# EasyEDA Pro project STM32C8.eprj

# Schematic STM32C8
Board Name: STM32C8; Create Date: 2022-11-13; Page Name: Core; Project Name: STM32C8; Schematic Name: STM32C8; Update Date: 2025-06-07; Company: My Company; Page Size: A4; Version: V1.0
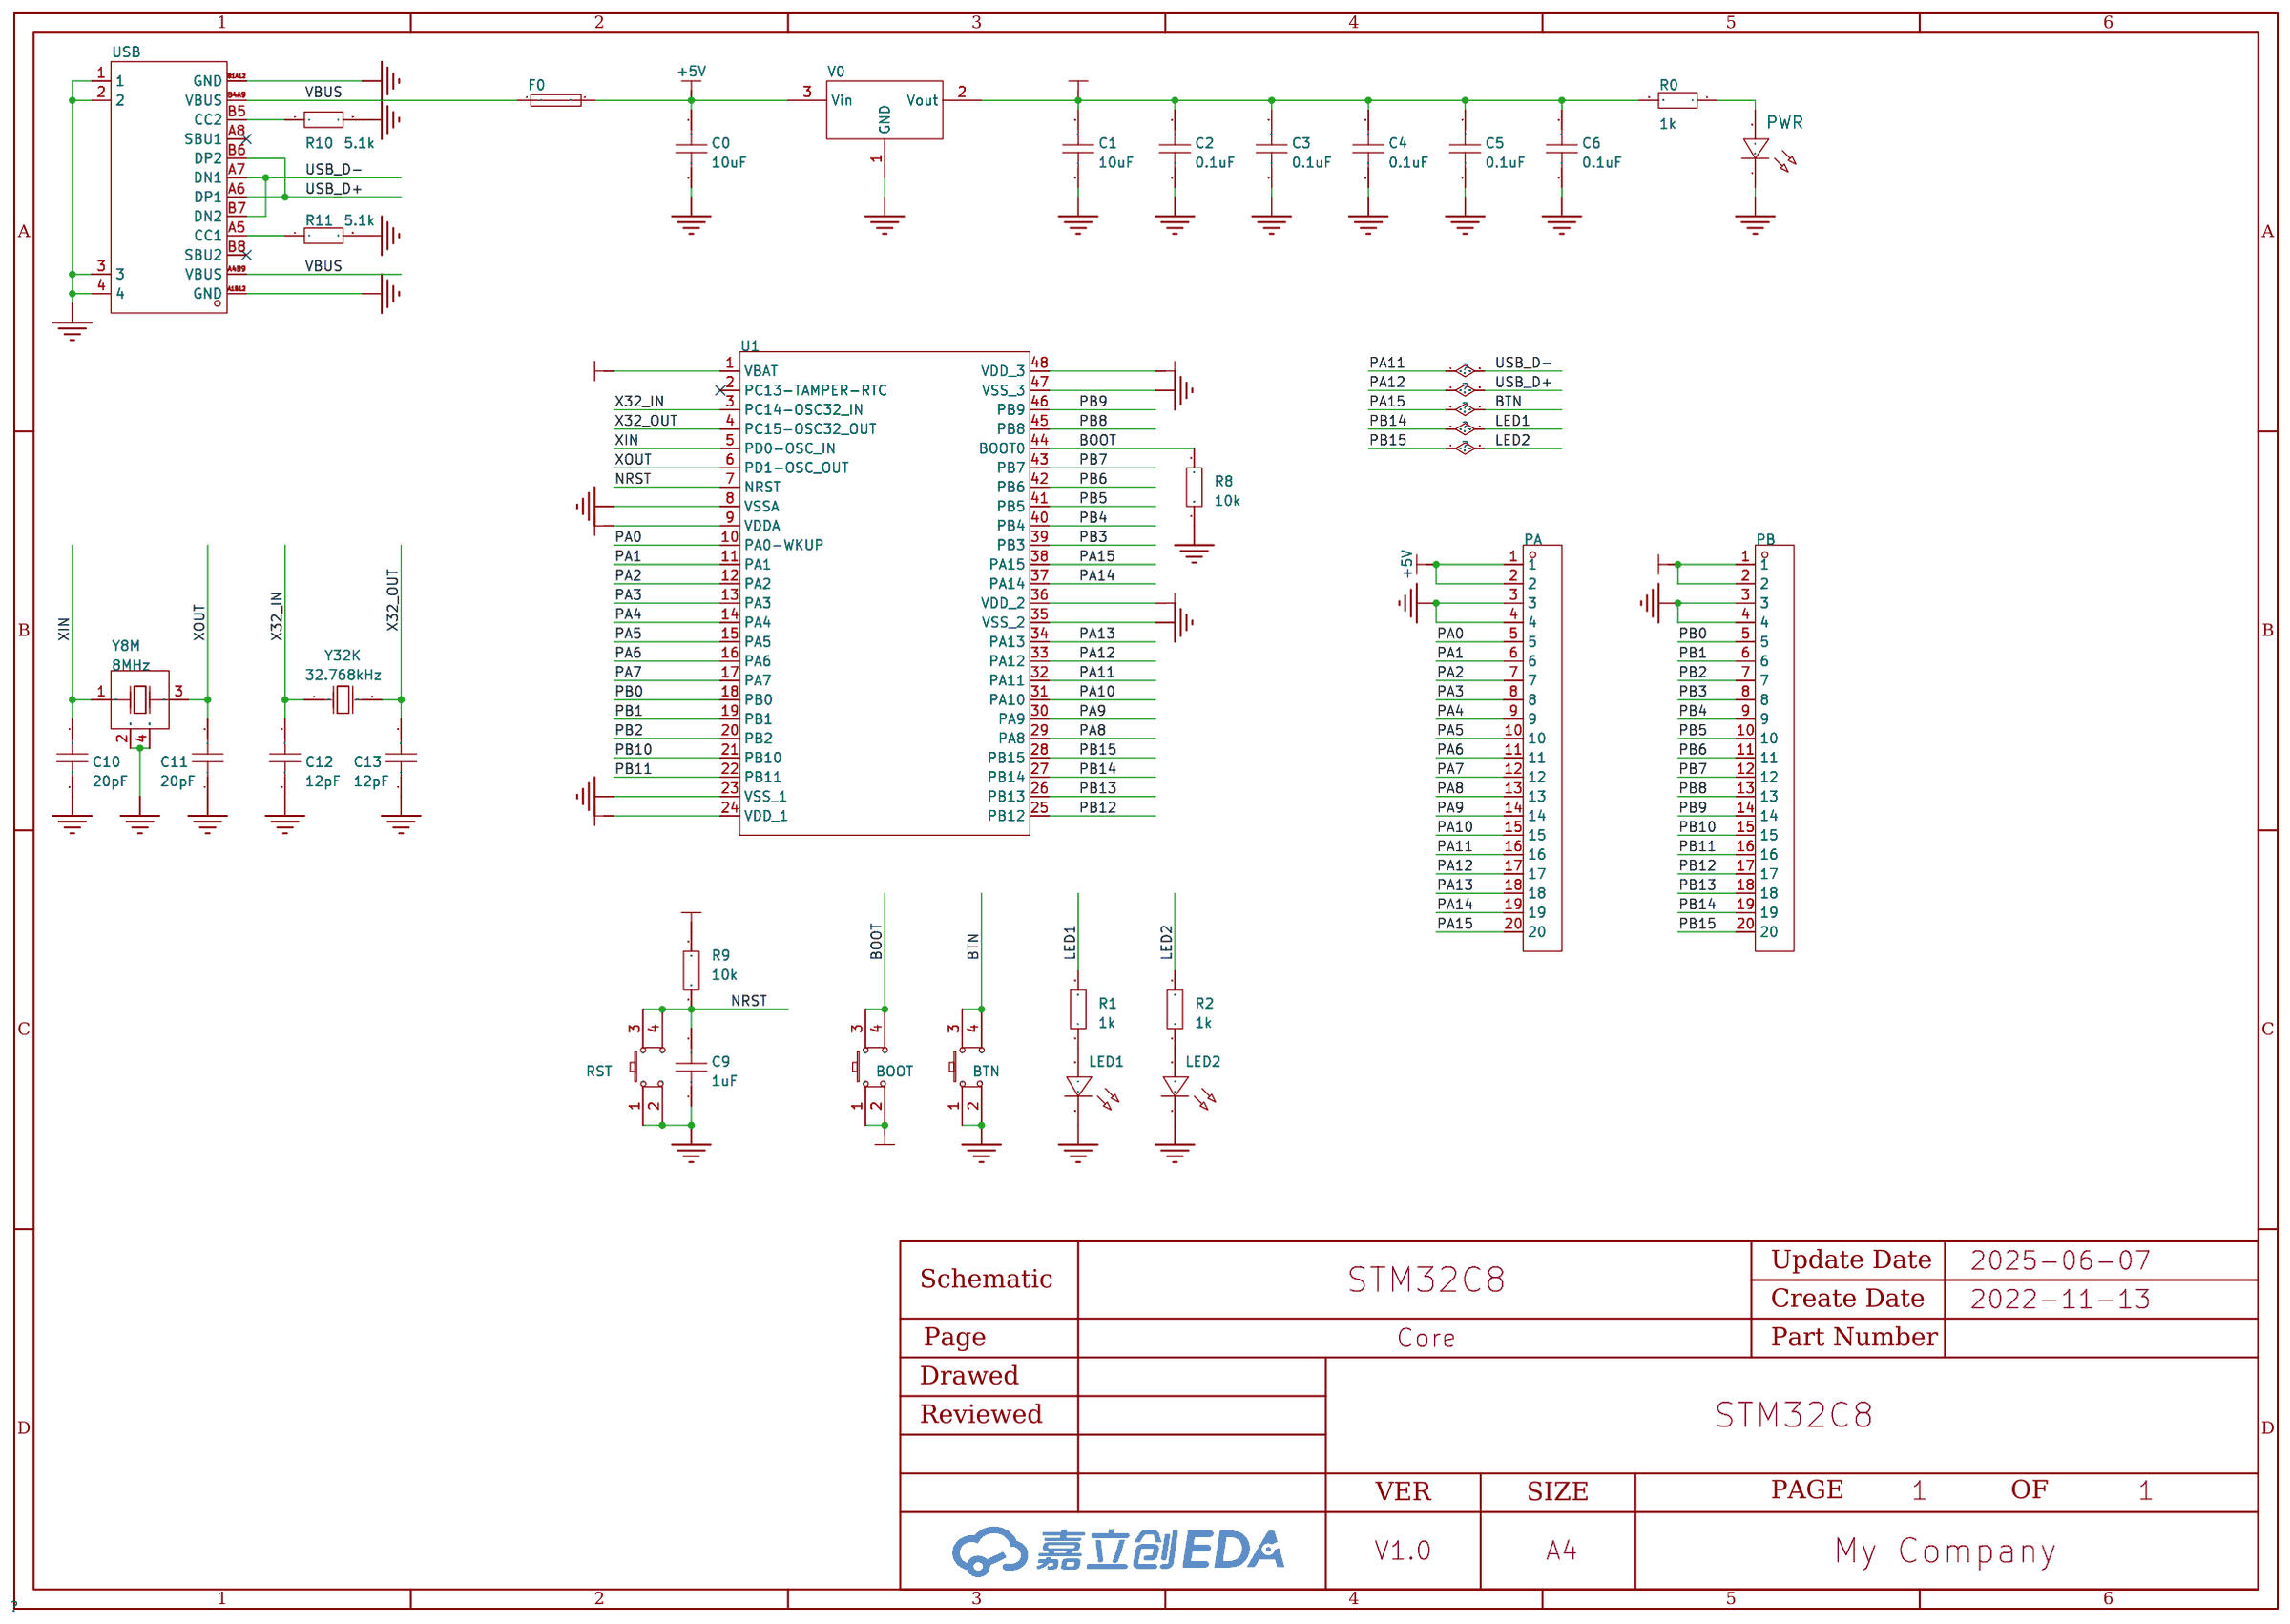
[diagram p0: schematic sheet]

## Parts
BOOT  PTS815SJK250SMTRLFS  [SW-SMD_4P-L4.2-W3.3-P2.15-LS5.1]
BTN  PTS815SJK250SMTRLFS  [SW-SMD_4P-L4.2-W3.3-P2.15-LS5.1]
C0  10uF  [C0603]
C1  10uF  [C0603]
C2  0.1uF  [C0603]
C3  0.1uF  [C0603]
C4  0.1uF  [C0603]
C5  0.1uF  [C0603]
C6  0.1uF  [C0603]
C9  1uF  [C0603]
C10  20pF  [C0603]
C11  20pF  [C0603]
C12  12pF  [C0603]
C13  12pF  [C0603]
F0  JK-nSMD100-16  [F1206]
LED1  -  [LED0603-RD_BLUE]
LED2  -  [LED0603-RD_BLUE]
PA  -  [HDR-TH_20P-P2.54-V-M-1]
PB  -  [HDR-TH_20P-P2.54-V-M-1]
PWR  -  [LED0603-RD_BLUE]
R0  1k  [R0603]
R1  1k  [R0603]
R2  1k  [R0603]
R8  10k  [R0603]
R9  10k  [R0603]
R10  5.1k  [R0603]
R11  5.1k  [R0603]
RST  PTS815SJK250SMTRLFS  [SW-SMD_4P-L4.2-W3.3-P2.15-LS5.1]
U1  STM32F103C8T6  [LQFP-48_L7.0-W7.0-P0.50-LS9.0-BL]
USB  USB-TYPE-C-017  [USB-TYPE-C-SMD_C9900008089]
V0  AMS1117-3.3  [SOT-89-3_L4.5-W2.5-P1.50-LS4.2-BR]
Y8M  8MHz  [CRYSTAL-SMD_4P-L3.2-W2.5-BL]
Y32K  32.768kHz  [OSC-SMD_L3.2-W1.5]

## Library data of the parts
BOOT BTN RST = PTS815SJK250SMTRLFS: 操作寿命10万次，使用温度-20°C 至 70°C,尺寸4.20mmx3.20mmx2.50mm，操作力度2.5N; LCSC Part Name: 轻触开关; Supplier Part: C918859; Manufacturer: C&K; Supplier Footprint: SMD; JLCPCB Part Class: 扩展库; Datasheet: https://atta.szlcsc.com/upload/public/pdf/source/20190916/C411883_4F77F16E1D8E48DC707D8949CEE7CF80.pdf; Supplier: LCSC
C0-C6 C9-C13 = CAP_0603: 容值:100nF;精度:±10%;额定电压:50V;温度系数:X7R;; Supplier Footprint: 0603
F0 = JK-nSMD100-16: LCSC Part Name: 16V 1A 1206自恢复; Supplier Part: C369161; Manufacturer: JK(金科); Supplier Footprint: 1206; JLCPCB Part Class: 扩展库; Datasheet: https://atta.szlcsc.com/upload/public/pdf/source/20190807/C409806_27B0F7EFFA3D5CEE60CCD1EE0A933E0A.pdf; Supplier: LCSC; Voltage - Max: 16V; Current - Max: 100A; Hold Current: 1A; Trip Current: 1.8A; Time to Trip(Max): 300ms
LED1 LED2 = LED_0603-B: 照明颜色:蓝色;主波长/色坐标:465~475nm;; Supplier Footprint: 0603; Supplier Part: C72041
PA PB = HDR-M_2.54_1x20P: 间距:2.54mm;总PIN位数:20;排数:1;插针结构:-;行距:-;安装类型:直插;圆针/方针:-;额定电流:-;额定电压:-;配合针长度:-;塑高:-;触头材质:黄铜;触头镀层:-;颜色:黑色;; Supplier Part: C50981; Supplier Footprint: 插件
PWR = LED_0603-R: 发光颜色:红灯;二极管配置:-;透镜颜色:无色透明;主波长:617.5nm;峰值波长:632nm;色温:-;光通量(25时):-;测试电流:5mA;正向电压(VF):2.2V;发光强度:28.5mcd;功率:60mW;发光角度:120°;安装方式:-;工作温度:-40~+85;; Supplier Footprint: 0603; Supplier Part: C72044
R0-R2 R8-R11 = Res_0603: Supplier Footprint: 0603
U1 = STM32F103C8T6: LCSC Part Name: 主流增强型ARM Cortex-M3 MCU，具有64 KB Flash、72 MHz CPU、电机控制、USB和CAN; Supplier Part: C8734; Manufacturer: ST(意法半导体); Supplier Footprint: LQFP-48(7x7); JLCPCB Part Class: 扩展库; Datasheet: https://atta.szlcsc.com/upload/public/pdf/source/20220812/8363ACEC51AD55ECEB84799464F7CB85.pdf; Supplier: LCSC; CPU Core: ARM-M3; CPU Maximum Speed: 72MHz; Program Storage Size: 64KB; Program Memory Type: FLASH; Number of I/O: 37; ADC (Bit): 12bit; Voltage - Supply: 2V~3.6V
USB = USB-TYPE-C-017: 连接器类型:Type-C;标准:-;公母:母座;触点数量:16;端口数量:1;安装方式:卧贴;额定电流 - 电源:3A;工作温度范围:-25~+85;; Supplier Part: C2927037; Manufacturer: DEALON(德艺隆); Supplier Footprint: SMD; JLCPCB Part Class: 扩展库; Datasheet: https://atta.szlcsc.com/upload/public/pdf/source/20211217/653222EE5174722C9DFE2966329956D8.pdf; Supplier: LCSC; Connector Type: Type-C; Gender: 母座; Number of Contacts: 16; Number of Ports: 1; Mounting Style: 卧贴; Current Rating - Power (Max): 3A; Operating Temperature Range: -25~+85
V0 = AMS1117-3.3_SOT-89: 输出类型:-;; Supplier Part: C880752; Manufacturer: Slkor(萨科微); Supplier Footprint: SOT-89-3; JLCPCB Part Class: 扩展库; Datasheet: https://atta.szlcsc.com/upload/public/pdf/source/20201231/C426566_7F22DB93439D00F3FA27143E4F28C6AA.pdf; Supplier: LCSC
Y8M = X32258MSB4SI: 频率:8MHz;频率公差:±10ppm;负载电容:20pF;; LCSC Part Name: 8MHz ±10ppm 20pF YSX321SL; Supplier Part: C2682774; Manufacturer: YXC(扬兴晶振); Supplier Footprint: SMD3225-4P; JLCPCB Part Class: 扩展库; Datasheet: https://atta.szlcsc.com/upload/public/pdf/source/20210106/C2682774_0CD4FDA5D9DA3FBEEC23BD607A48E4B0.pdf; Supplier: LCSC; Crystal Type: 贴片无源晶振; Frequency Tolerance: ±10ppm; Frequency Stability: ±30ppm; Load Capacitance: 20pF; Operating Temperature: -40℃~+85℃
Y32K = 7LC32768F12UC: 工作温度:-40~+85;工作温度:-40~+85;频率:32.768kHz;负载电容:12.5pF;晶振类型:贴片无源晶振;频率公差:±20ppm;频率公差:±20ppm;等效串联电阻(ESR):70kΩ;; LCSC Part Name: 32.768KHZ 12.5PF  ±20ppm; Supplier Part: C252398; Manufacturer: SJK(晶科鑫); Supplier Footprint: SMD-3215_2P; JLCPCB Part Class: 扩展库; Datasheet: https://atta.szlcsc.com/upload/public/pdf/source/20180725/C252398_B09721EBC402D2F46F4FCA4EBDD60A31.pdf; Supplier: LCSC; Operating Temperature: -40~+85; Load Capacitance: 12.5pF; Crystal Type: 贴片无源晶振; Frequency Tolerance: ±20ppm; Equivalent Series Resistance (ESR): 70kΩ

## Nets
+3.3V: BOOT.1 BOOT.2 C1.2 C2.2 C3.2 C4.1 C5.2 C6.2 PB.1 PB.2 R0.2 R9.2 U1.1(VBAT) U1.9(VDDA) U1.24(VDD_1) U1.36(VDD_2) U1.48(VDD_3) V0.2(Vout)
+5V: C0.2 F0.2 PA.1 PA.2 V0.3(Vin)
GND: BTN.1 BTN.2 C0.1 C1.1 C2.1 C3.1 C4.2 C5.1 C6.1 C9.1 C10.2 C11.1 C12.2 C13.1 LED1.1(C) LED2.1(C) PA.3 PA.4 PB.3 PB.4 PWR.1(C) R8.1 R10.2 R11.2 RST.1 RST.2 U1.8(VSSA) U1.23(VSS_1) U1.35(VSS_2) U1.47(VSS_3) USB.1 USB.2 USB.3 USB.4 USB.A1B12(GND) USB.B1A12(GND) V0.1(GND) Y8M.2(GND) Y8M.4(GND)
VBUS: F0.1 USB.A4B9(VBUS) USB.B4A9(VBUS)
BOOT: BOOT.3 BOOT.4 R8.2 U1.44(BOOT0)
BTN: BTN.3 BTN.4 PA.20 U1.38(PA15)
LED1: PB.19 R1.2 U1.27(PB14)
LED2: PB.20 R2.2 U1.28(PB15)
NRST: C9.2 R9.1 RST.3 RST.4 U1.7(NRST)
PA0: PA.5 U1.10(PA0-WKUP)
PA1: PA.6 U1.11(PA1)
PA2: PA.7 U1.12(PA2)
PA3: PA.8 U1.13(PA3)
PA4: PA.9 U1.14(PA4)
PA5: PA.10 U1.15(PA5)
PA6: PA.11 U1.16(PA6)
PA7: PA.12 U1.17(PA7)
PA8: PA.13 U1.29(PA8)
PA9: PA.14 U1.30(PA9)
PA10: PA.15 U1.31(PA10)
PA11: PA.16 U1.32(PA11) USB.A7(DN1) USB.B7(DN2)
PA12: PA.17 U1.33(PA12) USB.A6(DP1) USB.B6(DP2)
PA13: PA.18 U1.34(PA13)
PA14: PA.19 U1.37(PA14)
PB0: PB.5 U1.18(PB0)
PB1: PB.6 U1.19(PB1)
PB2: PB.7 U1.20(PB2)
PB3: PB.8 U1.39(PB3)
PB4: PB.9 U1.40(PB4)
PB5: PB.10 U1.41(PB5)
PB6: PB.11 U1.42(PB6)
PB7: PB.12 U1.43(PB7)
PB8: PB.13 U1.45(PB8)
PB9: PB.14 U1.46(PB9)
PB10: PB.15 U1.21(PB10)
PB11: PB.16 U1.22(PB11)
PB12: PB.17 U1.25(PB12)
PB13: PB.18 U1.26(PB13)
X32_IN: C12.1 U1.3(PC14-OSC32_IN) Y32K.1(OSC1)
X32_OUT: C13.2 U1.4(PC15-OSC32_OUT) Y32K.2(OSC2)
XIN: C10.1 U1.5(PD0-OSC_IN) Y8M.1(OSC1)
XOUT: C11.2 U1.6(PD1-OSC_OUT) Y8M.3(OSC2)
$1N6020: R11.1 USB.A5(CC1)
$1N6021: R10.1 USB.B5(CC2)
$1N6031: PWR.2(A) R0.1
$1N6193: LED1.2(A) R1.1
$1N6196: LED2.2(A) R2.1

Not connected (* = marked no-connect by the designer): U1 2(PC13-TAMPER-RTC)*; USB A8(SBU1)* B8(SBU2)*

# Board STM32C8
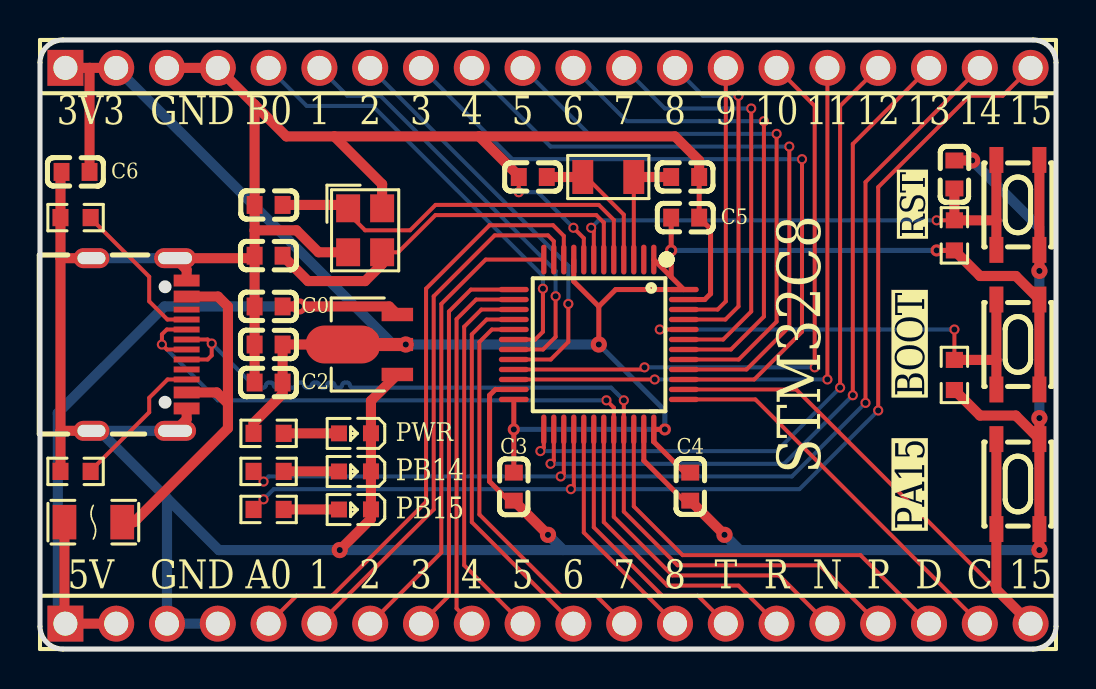
[diagram p1: board, top side]
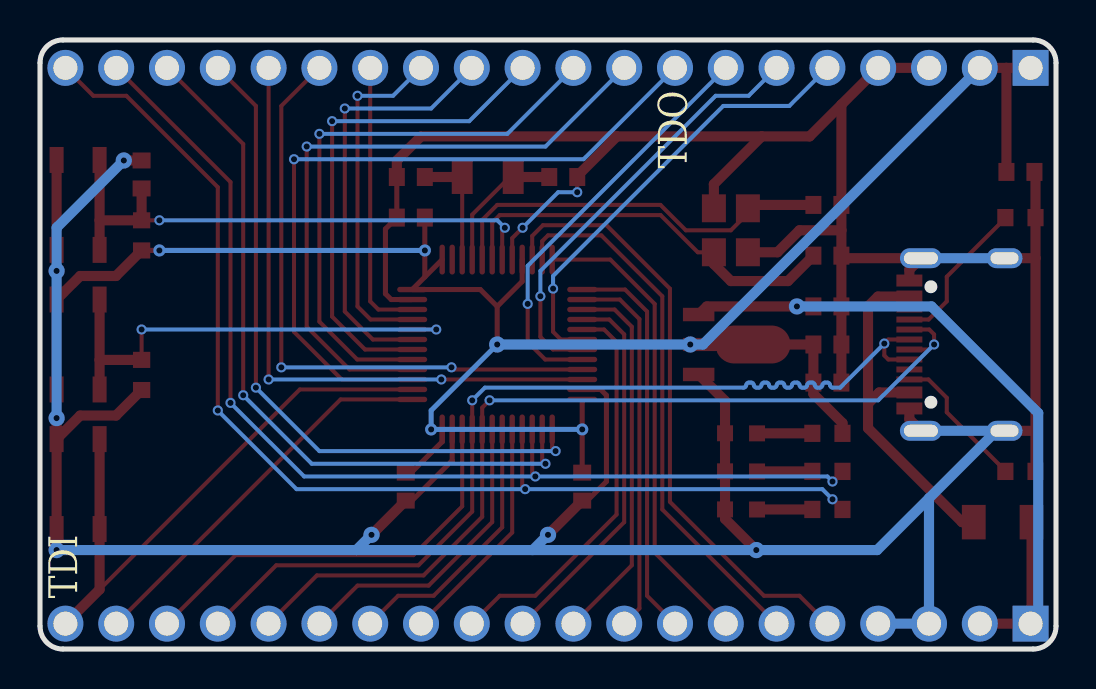
[diagram p2: board, bottom side, seen from below]

Outline 50.8 x 30.48 mm; copper layers: Top Layer, Bottom Layer. Coordinates in mm from the lower left corner of the outline.
Outline path: 0,29.34 0,1.14 arc(0.33,0.33) 1.14,0 49.66,0 arc(50.47,0.33) 50.8,1.14 50.8,29.34 arc(50.47,30.15) 49.66,30.48 1.14,30.48 arc(0.33,30.15) 0,29.34
Stack: Top Layer 0.035mm / Dielectric1 1.51mm FR4 er 4.5 / Bottom Layer 0.035mm

## Design rules (mm)
spacing safeClearance (default): track to track 0.152, other pairs 0.152 to 0.3
track width trackWidth (default): min 0.127, default 0.254, max 2.54
differential pair differentialPair (default): width min 0.127, default 0.254, max 2.54; gap min 0.152, default 0.152
via viaSize (default): diameter min 0.5, default 0.61, max 10; hole min 0.3, default 0.305, max 6

## Placement (name value [footprint] x y rotation side)
BOOT  PTS815SJK250SMTRLFS  [SW-SMD_4P-L4.2-W3.3-P2.15-LS5.1]  48.9 15.24 270 top
BTN  PTS815SJK250SMTRLFS  [SW-SMD_4P-L4.2-W3.3-P2.15-LS5.1]  48.9 8.25 270 top
C0  10uF  [C0603]  11.43 17.14 0 top
C1  10uF  [C0603]  11.43 15.24 0 top
C2  0.1uF  [C0603]  11.43 13.33 0 top
C3  0.1uF  [C0603]  23.69 8.13 90 top
C4  0.1uF  [C0603]  32.51 8.13 270 top
C5  0.1uF  [C0603]  32.26 21.59 180 top
C6  0.1uF  [C0603]  1.78 23.88 0 top
C9  1uF  [C0603]  45.72 23.75 270 top
C10  20pF  [C0603]  11.43 22.22 180 top
C11  20pF  [C0603]  11.43 19.69 0 top
C12  12pF  [C0603]  32.26 23.62 0 top
C13  12pF  [C0603]  24.64 23.62 0 top
F0  JK-nSMD100-16  [F1206]  2.67 6.35 180 top
LED1  -  [LED0603-RD_BLUE]  15.75 8.89 180 top
LED2  -  [LED0603-RD_BLUE]  15.75 6.98 180 top
PA  -  [HDR-TH_20P-P2.54-V-M-1]  25.4 1.27 0 top
PB  -  [HDR-TH_20P-P2.54-V-M-1]  25.4 29.08 0 top
PWR  -  [LED0603-RD_BLUE]  15.75 10.8 180 top
R0  1k  [R0603]  11.43 10.8 180 top
R1  1k  [R0603]  11.43 8.89 180 top
R2  1k  [R0603]  11.43 6.98 180 top
R8  10k  [R0603]  45.72 13.72 90 top
R9  10k  [R0603]  45.72 20.7 270 top
R10  5.1k  [R0603]  1.78 8.89 180 top
R11  5.1k  [R0603]  1.78 21.59 180 top
RST  PTS815SJK250SMTRLFS  [SW-SMD_4P-L4.2-W3.3-P2.15-LS5.1]  48.9 22.22 270 top
U1  STM32F103C8T6  [LQFP-48_L7.0-W7.0-P0.50-LS9.0-BL]  27.94 15.24 180 top
USB  USB-TYPE-C-017  [USB-TYPE-C-SMD_C9900008089]  4.95 15.24 270 top
V0  AMS1117-3.3  [SOT-89-3_L4.5-W2.5-P1.50-LS4.2-BR]  16.51 15.24 0 top
Y8M  8MHz  [CRYSTAL-SMD_4P-L3.2-W2.5-BL]  16.26 20.95 270 top
Y32K  32.768kHz  [OSC-SMD_L3.2-W1.5]  28.41 23.62 180 top

## Footprints (pads in the part's own frame, mm; a bottom-side part is the same pattern mirrored in y, then rotated)
C0603
  rect 0.8x0.9 smd: 1(-0.7,0) 2(0.7,0)
CRYSTAL-SMD_4P-L3.2-W2.5-BL
  rect 1.4x1.2 smd: 1(-1.1,-0.85) 2(1.1,-0.85) 3(1.1,0.85) 4(-1.1,0.85)
F1206
  rect 1.19x1.728 smd: 1(-1.445,0) 2(1.445,0)
HDR-TH_20P-P2.54-V-M-1
  rect 1.801x1.801 hole 1.199: 1(-24.13,0)
  round 1.801 hole 1.199: 2(-21.59,0) 3(-19.05,0) 4(-16.51,0) 5(-13.97,0) 6(-11.43,0) 7(-8.89,0) 8(-6.35,0) 9(-3.81,0) 10(-1.27,0) 11(1.27,0) 12(3.81,0) 13(6.35,0) 14(8.89,0) 15(11.43,0) 16(13.97,0) 17(16.51,0) 18(19.05,0) 19(21.59,0) 20(24.13,0)
LED0603-RD_BLUE
  rect 0.8x0.8 smd: 1(-0.8,-0.003) 2(0.8,0.003)
LQFP-48_L7.0-W7.0-P0.50-LS9.0-BL
  oval 0.27x1.5 smd: 1(-2.75,-4.25) 2(-2.25,-4.25) 3(-1.75,-4.25) 4(-1.25,-4.25) 5(-0.75,-4.25) 6(-0.25,-4.25) 7(0.25,-4.25) 8(0.75,-4.25) 9(1.25,-4.25) 10(1.75,-4.25) 11(2.25,-4.25) 12(2.75,-4.25) 25(2.75,4.25) 26(2.25,4.25) 27(1.75,4.25) 28(1.25,4.25) 29(0.75,4.25) 30(0.25,4.25) 31(-0.25,4.25) 32(-0.75,4.25) 33(-1.25,4.25) 34(-1.75,4.25) 35(-2.25,4.25) 36(-2.75,4.25)
  oval 1.5x0.27 smd: 13(4.25,-2.75) 14(4.25,-2.25) 15(4.25,-1.75) 16(4.25,-1.25) 17(4.25,-0.75) 18(4.25,-0.25) 19(4.25,0.25) 20(4.25,0.75) 21(4.25,1.25) 22(4.25,1.75) 23(4.25,2.25) 24(4.25,2.75) 37(-4.25,2.75) 38(-4.25,2.25) 39(-4.25,1.75) 40(-4.25,1.25) 41(-4.25,0.75) 42(-4.25,0.25) 43(-4.25,-0.25) 44(-4.25,-0.75) 45(-4.25,-1.25) 46(-4.25,-1.75) 47(-4.25,-2.25) 48(-4.25,-2.75)
OSC-SMD_L3.2-W1.5
  rect 1.049x1.7 smd: 1(-1.275,0) 2(1.275,0)
R0603
  rect 0.806x0.864 smd: 1(-0.753,0) 2(0.753,0)
SOT-89-3_L4.5-W2.5-P1.50-LS4.2-BR
  rect 1.575x0.672 smd: 1(1.356,-1.5) 3(1.356,1.5)
  custom 5.377x1.9 smd: 2(-1.356,0)
SW-SMD_4P-L4.2-W3.3-P2.15-LS5.1
  rect 1.3x0.701 smd: 1(-2.251,1.075) 2(2.251,1.075) 3(-2.251,-1.075) 4(2.251,-1.075)
USB-TYPE-C-SMD_C9900008089
  oval 1x2.1 hole 0.6x1.7: 1(-4.32,1.801) 2(4.32,1.801)
  oval 1x1.8 hole 0.6x1.4: 3(-4.32,-2.379) 4(4.32,-2.379)
  rect 0.6x1.3 smd: A1B12(-3.2,2.379) A4B9(-2.4,2.379) B1A12(3.2,2.379) B4A9(2.4,2.379)
  rect 0.3x1.3 smd: A5(-1.25,2.379) A6(-0.25,2.379) A7(0.25,2.379) A8(1.25,2.379) B5(1.75,2.379) B6(0.75,2.379) B7(-0.75,2.379) B8(-1.75,2.379)

## Nets
As in the schematic.

Pads without a net: U1 2; USB A8 B8

## Via types
v1: diameter 0.813, hole 0.305, Top Layer to Bottom Layer, 10 vias
v2: diameter 0.508, hole 0.305, Top Layer to Bottom Layer, 33 vias
v3: diameter 0.61, hole 0.305, Top Layer to Bottom Layer, 4 vias

## Routing (per net, layer and track width the routed paths; a pad name or vN(x,y) marks a point on that pad's centre or on a via; arc(x,y) is an arc through that point)
+3.3V: length 104.5
  Top Layer w0.254: U1.9 26.69,18.39 27.94,17.14 ; U1.24 C3.2 ; 27.94,17.14 28.78,17.99 U1.48 31.56,18.62 ; 27.94,17.14 v1(27.94,15.24) ; U1.1 31.56,18.62 ; 31.56,18.62 C5.2 ; v3(31.24,10.99) U1.36 30.69,10.38 32.24,8.83 C4.1 ; R9.2 v3(44.83,19.95)
  Top Layer w0.508: V0.2 C1.2 C2.2 12.13,12.77 10.68,11.31 R0.2 ; R9.2 47,18.67 48.79,18.67 BOOT.1 BOOT.2 ; PB.1 2.48,29.08 ; 2.48,29.08 C6.2 ; 2.48,29.08 PB.2
  Bottom Layer w0.254: v1(27.94,15.24) 31.24,11.94 v3(31.24,10.99) v3(23.69,10.99) ; v3(31.56,19.95) v3(44.83,19.95)
  Bottom Layer w0.508: v1(27.94,15.24) v1(18.29,15.24) 17.65,15.24 PB.2
+5V: length 38.5
  Top Layer w0.508: F0.2 1.22,1.32 PA.1 PA.2 ; V0.3 17.46,17.14 C0.2
  Bottom Layer w0.508: PA.1 0.89,1.65 0.89,11.81 6.22,17.14 v1(12.95,17.14)
GND: length 222.4
  Top Layer w0.203: v2(26.67,21.08) 27.19,20.56 U1.8 ; C13.1 v2(23.94,22.86)
  Top Layer w0.254: C3.1 23.43,7.43 22.48,8.38 22.48,12.7 22.77,12.99 U1.23 ; C4.2 32.2,7.43 30.19,9.43 U1.35 ; C12.2 C5.1 33.53,21.02 33.53,17.78 33.24,17.49 U1.47
  Top Layer w0.508: v1(14.99,4.95) 16.55,6.52 LED2.1 LED1.1 PWR.1 16.55,12.42 V0.1 ; 1.02,19.56 R11.2 1.02,23.82 C6.1 ; 1.02,19.56 USB.3 ; 1.02,19.56 1.02,10.92 ; C4.2 v1(34.22,5.72) ; 10.73,19.56 C0.1 C1.1 C2.1 ; 10.73,19.56 USB.1 7.33,18.98 USB.A1B12 ; 10.73,19.56 C11.1 10.73,20.95 ; v1(49.97,4.95) BTN.2 BTN.1 ; RST.1 RST.2 v1(49.97,18.92) ; 10.73,27.24 C10.2 10.73,20.95 ; 10.73,27.24 PB.4 PB.3 ; 10.73,27.24 12.32,25.65 14.72,25.65 ; C12.2 32.96,24.45 31.75,25.65 21.96,25.65 ; v1(25.4,5.72) 25.4,5.72 C3.1 ; BTN.1 48.79,11.68 47,11.68 R8.1 ; BTN.1 v1(49.97,11.56) ; 14.72,25.65 17.11,23.26 17.11,22.06 ; 14.72,25.65 21.96,25.65 ; 21.96,25.65 23.94,23.67 C13.1 ; 10.73,20.95 12.83,20.95 13.93,19.86 Y8M.2 ; R10.2 1.02,10.92 ; 1.02,10.92 USB.4 ; USB.2 7.33,11.5 USB.B1A12 ; C9.1 v1(46.61,24.45)
  Bottom Layer w0.203: v2(23.94,22.86) 24.89,22.86 v2(26.67,21.08)
  Bottom Layer w0.508: 2.97,10.92 USB.4 ; 2.97,10.92 USB.2 ; 2.97,10.92 6.35,7.54 ; v1(34.22,5.72) 34.99,4.95 ; 34.99,4.95 v1(49.97,4.95) ; 34.99,4.95 26.16,4.95 ; v1(49.97,11.56) v1(49.97,18.92) 49.97,21.09 v1(46.61,24.45) ; 6.35,7.54 8.94,4.95 v1(14.99,4.95) 26.16,4.95 ; 6.35,7.54 PA.3 PA.4 ; 26.16,4.95 v1(25.4,5.72) ; USB.3 USB.1
VBUS: length 17.9
  Top Layer w0.508: F0.1 4.7,6.35 9.4,11.05 9.4,12.28 ; 9.4,12.28 8.84,12.84 USB.B4A9 ; 9.4,12.28 9.4,17.14 8.9,17.64 USB.A4B9
BOOT: length 24.1
  Top Layer w0.203: v2(45.72,15.99) R8.2 ; U1.44 v2(30.99,15.99)
  Top Layer w0.508: R8.2 47.82,14.47 ; 47.82,14.47 BOOT.4 ; 47.82,14.47 BOOT.3
  Bottom Layer w0.203: v2(30.99,15.99) v2(45.72,15.99)
BTN: length 29.7
  Top Layer w0.203: U1.38 37.81,12.99 47.82,2.98
  Top Layer w0.508: BTN.3 BTN.4 47.82,2.98 PA.20
LED1: length 54
  Top Layer w0.203: R1.2 10.68,8.88 v2(11.18,8.38) ; v2(26.03,8.64) 26.19,8.79 U1.27 ; PB.19 41.28,23.37 v2(41.28,12.32)
  Bottom Layer w0.203: v2(41.28,12.32) 37.59,8.64 v2(26.03,8.64) 11.43,8.64 v2(11.18,8.38)
LED2: length 57.6
  Top Layer w0.203: PB.20 48.13,27.69 46.48,27.69 41.91,23.11 v2(41.91,11.94) ; R2.2 10.68,6.99 v2(11.18,7.49) ; U1.28 26.69,8.15 v2(26.54,8)
  Bottom Layer w0.203: v2(11.18,7.49) 11.68,8 v2(26.54,8) 37.97,8 v2(41.91,11.94)
NRST: length 28.2
  Top Layer w0.203: v2(27.56,21.08) 27.69,20.95 U1.7 ; R9.1 v2(44.83,21.45)
  Top Layer w0.508: 47.82,21.45 R9.1 C9.2 ; 47.82,21.45 RST.3 ; 47.82,21.45 RST.4
  Bottom Layer w0.203: v2(27.56,21.08) 27.93,21.45 v2(44.83,21.45)
PA0: length 30.7
  Top Layer w0.203: PA.5 12.83,2.67 14.6,2.67 19.3,7.37 19.3,18.03 22.48,21.21 25.65,21.21 26.19,20.67 U1.10
PA1: length 27.1
  Top Layer w0.203: PA.6 19.69,6.98 19.69,17.65 22.73,20.7 25.4,20.7 25.69,20.41 U1.11
PA2: length 23.5
  Top Layer w0.203: U1.12 22.28,19.49 20.07,17.27 20.07,4.83 PA.7
PA3: length 19.9
  Top Layer w0.203: PA.8 20.45,2.67 20.45,16.89 21.55,17.99 U1.13
PA4: length 18.8
  Top Layer w0.203: U1.14 21.81,17.49 20.83,16.51 20.83,2.03 PA.9
PA5: length 18.9
  Top Layer w0.203: U1.15 22.07,16.99 21.21,16.13 21.21,4.19 PA.10
PA6: length 19
  Top Layer w0.203: U1.16 22.33,16.49 21.59,15.75 21.59,6.35 PA.11
PA7: length 20.1
  Top Layer w0.203: PA.12 27.81,2.67 26.03,2.67 21.97,6.73 21.97,15.37 22.59,15.99 U1.17
PA8: length 11.6
  Top Layer w0.203: PA.13 27.19,5.83 U1.29
PA9: length 13.5
  Top Layer w0.203: PA.14 32.89,2.67 31.12,2.67 27.69,6.09 U1.30
PA10: length 15.4
  Top Layer w0.203: PA.15 34.93,3.17 31.37,3.17 28.19,6.35 U1.31
PA11: length 45.4
  Top Layer w0.203: PA.16 36.96,3.68 31.62,3.68 28.69,6.62 U1.32 28.69,12.08 v2(28.32,12.45) ; USB.B7 6.34,15.99 6.1,15.75 v2(6.1,15.24) 6.35,14.99 USB.A7
  Bottom Layer w0.203: v2(6.1,15.24) 8.89,12.45 v2(28.32,12.45)
PA12: length 47.4
  Top Layer w0.203: v2(29.19,12.45) U1.33 29.19,6.88 31.88,4.19 38.99,4.19 PA.17 ; USB.B6 8.38,14.49 8.59,14.69 v2(8.59,15.29) 8.38,15.49 USB.A6
  Bottom Layer w0.203: v2(29.19,12.45) 28.56,13.08 15.62,13.08 arc(15.53,13.12) 15.49,13.21 arc(15.45,13.3) 15.36,13.33 15.24,13.33 arc(15.15,13.3) 15.11,13.21 arc(15.07,13.12) 14.98,13.08 14.85,13.08 arc(14.77,13.12) 14.73,13.21 arc(14.69,13.3) 14.6,13.33 14.47,13.33 arc(14.38,13.3) 14.35,13.21 arc(14.31,13.12) 14.22,13.08 14.09,13.08 arc(14,13.12) 13.97,13.21 arc(13.93,13.3) 13.84,13.33 13.71,13.33 arc(13.62,13.3) 13.59,13.21 arc(13.55,13.12) 13.46,13.08 13.33,13.08 arc(13.24,13.12) 13.2,13.21 arc(13.17,13.3) 13.08,13.33 12.95,13.33 arc(12.86,13.3) 12.82,13.21 arc(12.79,13.12) 12.7,13.08 12.57,13.08 arc(12.48,13.12) 12.44,13.21 arc(12.4,13.3) 12.31,13.33 12.19,13.33 arc(12.1,13.3) 12.06,13.21 arc(12.02,13.12) 11.93,13.08 11.81,13.08 arc(11.72,13.12) 11.68,13.21 arc(11.64,13.3) 11.55,13.33 11.43,13.33 arc(11.34,13.3) 11.3,13.21 arc(11.26,13.12) 11.17,13.08 10.79,13.08 v2(8.59,15.29)
PA13: length 21
  Top Layer w0.203: U1.34 29.69,7.14 32.13,4.7 41.02,4.7 PA.18
PA14: length 19.4
  Top Layer w0.203: U1.37 35.77,12.49 PA.19
PB0: length 22.4
  Top Layer w0.203: v2(25.15,18.03) 25.15,15.88 24.76,15.49 U1.18
  Bottom Layer w0.203: v2(25.15,18.03) 25.15,18.67 16.64,27.18 13.34,27.18 PB.5
PB1: length 21.7
  Top Layer w0.203: v2(25.78,17.65) 25.78,15.62 25.15,14.99 U1.19
  Bottom Layer w0.203: PB.6 15.37,27.69 17.02,27.69 25.78,18.92 v2(25.78,17.65)
PB2: length 20.9
  Top Layer w0.203: v2(26.42,17.27) 26.42,15.37 25.54,14.49 U1.20
  Bottom Layer w0.203: PB.7 26.42,19.18 v2(26.42,17.27)
PB3: length 36.5
  Top Layer w0.203: v2(38.1,24.51) 38.1,15.88 35.72,13.49 U1.39
  Bottom Layer w0.203: PB.8 23.62,24.51 v2(38.1,24.51)
PB4: length 32.7
  Top Layer w0.203: v2(37.47,25.15) 37.47,16.13 35.33,13.99 U1.40
  Bottom Layer w0.203: v2(37.47,25.15) 25.53,25.15 PB.9
PB5: length 28.9
  Top Layer w0.203: v2(36.83,25.78) 36.83,16.38 34.94,14.49 U1.41
  Bottom Layer w0.203: PB.10 27.43,25.78 v2(36.83,25.78)
PB6: length 25.1
  Top Layer w0.203: v2(36.19,26.42) 36.19,16.64 34.55,14.99 U1.42
  Bottom Layer w0.203: PB.11 29.34,26.42 v2(36.19,26.42)
PB7: length 21.3
  Top Layer w0.203: v2(35.56,27.05) 35.56,16.89 34.16,15.49 U1.43
  Bottom Layer w0.203: PB.12 31.24,27.05 v2(35.56,27.05)
PB8: length 17.3
  Top Layer w0.203: v2(34.93,27.69) 34.93,17.14 34.27,16.49 U1.45
  Bottom Layer w0.203: PB.13 33.15,27.69 v2(34.93,27.69)
PB9: length 14
  Top Layer w0.203: PB.14 34.29,17.4 33.88,16.99 U1.46
PB10: length 30.9
  Top Layer w0.203: v2(30.23,14.1) 30.12,13.99 U1.21 ; v2(38.74,14.1) 38.74,27.18 PB.15
  Bottom Layer w0.203: v2(30.23,14.1) v2(38.74,14.1)
PB11: length 31.3
  Top Layer w0.203: U1.22 v2(30.73,13.49) ; v2(39.37,13.49) PB.16
  Bottom Layer w0.203: v2(39.37,13.49) v2(30.73,13.49)
PB12: length 34.2
  Top Layer w0.203: v2(40,13.08) 40,27.18 PB.17 ; U1.25 25.19,10.08 v2(25.02,9.91)
  Bottom Layer w0.203: v2(40,13.08) 36.83,9.91 v2(25.02,9.91)
PB13: length 36.3
  Top Layer w0.203: v2(25.53,9.27) 25.69,9.43 U1.26 ; PB.18 40.64,25.27 v2(40.64,12.7)
  Bottom Layer w0.203: v2(25.53,9.27) 37.21,9.27 v2(40.64,12.7)
X32_IN: length 6
  Top Layer w0.203: U1.3 Y32K.1
  Top Layer w0.508: Y32K.1 C12.1
X32_OUT: length 6.9
  Top Layer w0.203: Y32K.2 27.31,23.62 29.19,21.74 U1.4
  Top Layer w0.508: C13.2 Y32K.2
XIN: length 20.1
  Top Layer w0.203: U1.5 28.69,21.47 27.94,22.22 19.78,22.22 18.51,20.95 16.26,20.95 15.41,21.81 15.41,22.06
  Top Layer w0.508: 15.41,22.06 15.24,22.22 C10.1
XOUT: length 20.3
  Top Layer w0.203: U1.6 28.19,21.34 27.81,21.72 19.77,21.72 17.91,19.86 Y8M.3
  Top Layer w0.508: Y8M.3 17.11,19.27 16.26,18.42 13.4,18.42 C11.2
$1N6020: length 7.7
  Top Layer w0.203: R11.1 2.53,21.56 5.46,18.63 5.46,17.4 6.37,16.49 USB.A5
$1N6021: length 7.1
  Top Layer w0.203: USB.B5 6.38,13.49 5.46,12.57 5.46,11.85 2.53,8.92 R10.1
$1N6031: length 2.8
  Top Layer w0.508: PWR.2 14.95,10.8 R0.1
$1N6193: length 2.8
  Top Layer w0.508: LED1.2 14.95,8.89 R1.1
$1N6196: length 2.8
  Top Layer w0.508: LED2.2 14.95,6.98 R2.1

## Text on the board
Bottom Silkscreen Layer: TDI | TDO
Top Silkscreen Layer: PB14 | PB15 | 3V3 | GND | B0 | 1 | 2 | 3 | 4 | 5 | 6 | 7 | 8 | 9 | 10 | 11 | 12 | 13 | 14 | 15 | 5V | T | R | N | P | D | C | BOOT | PA15 | A0 | STM32C8
